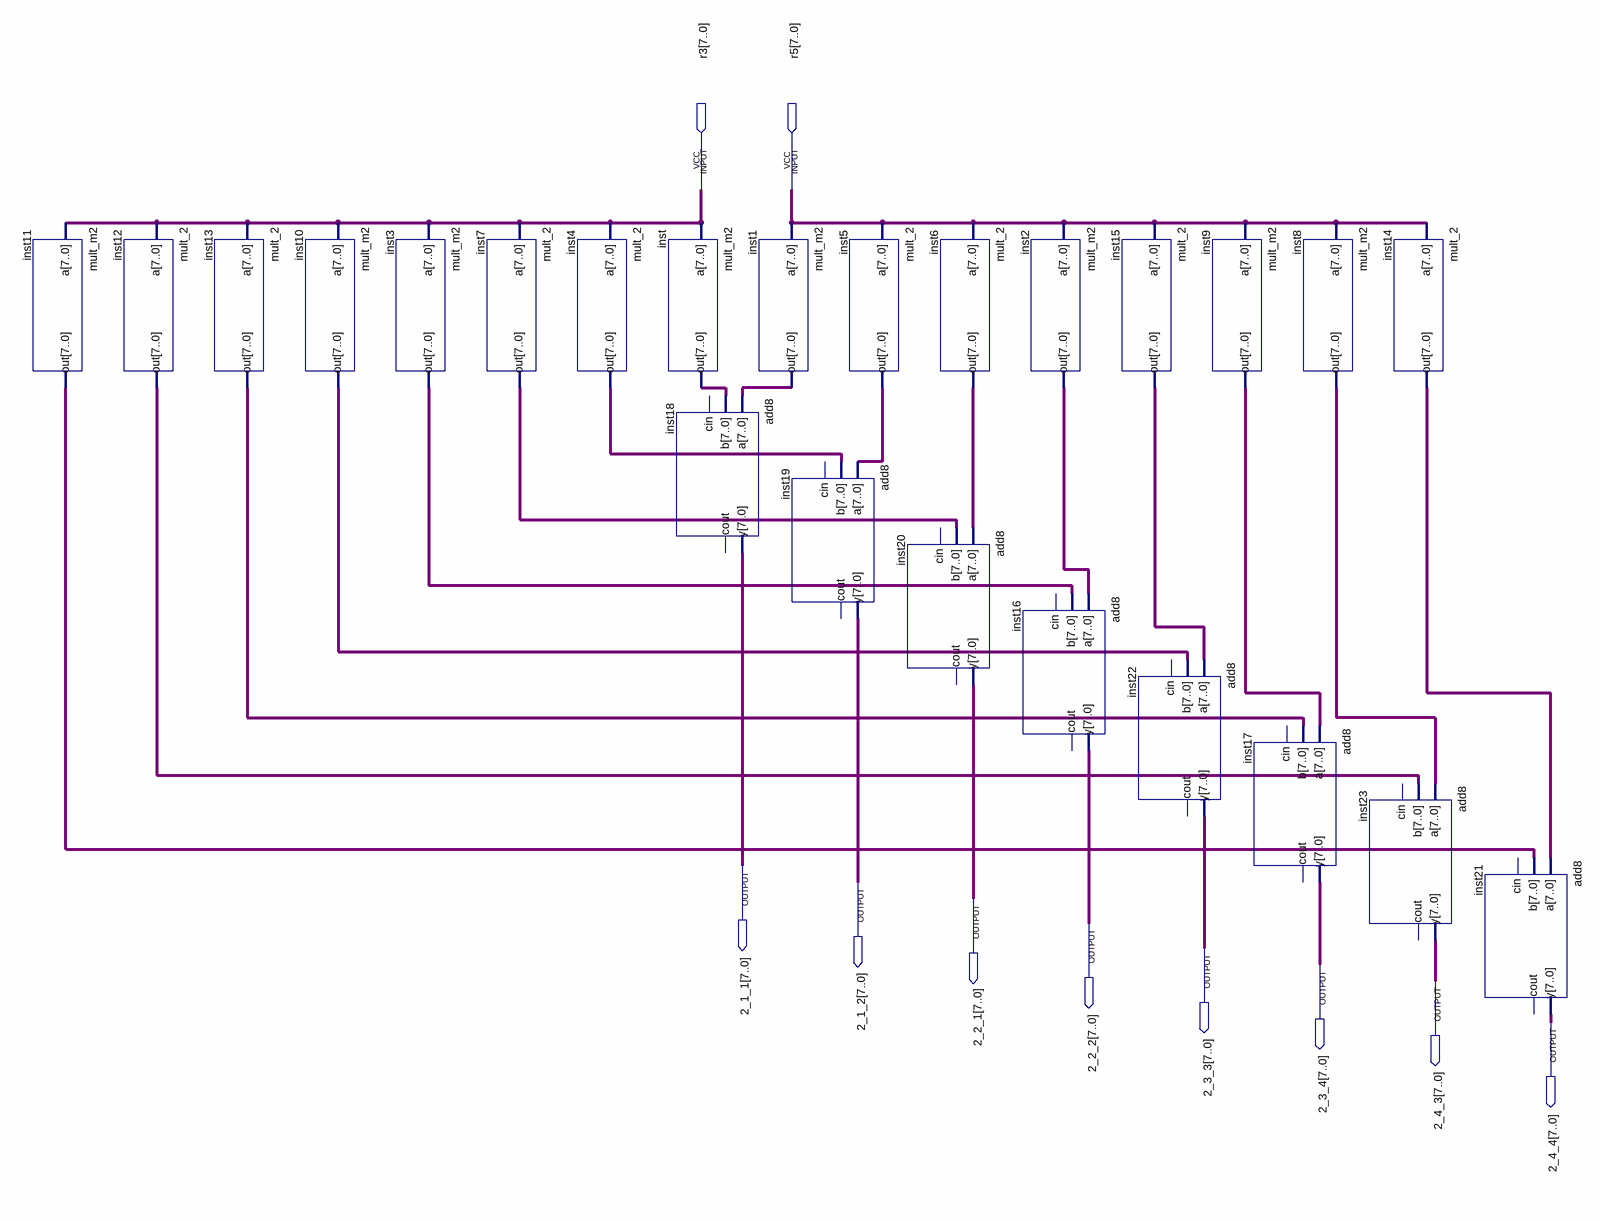
[diagram p0: schematic sheet]
// Quartus schematic stage_2.bdf as structural Verilog: 24 symbols, 10 pins
module stage_2 (
  input  [7:0] r3,
  input  [7:0] r5,
  output [7:0] \2_1_1 ,
  output [7:0] \2_1_2 ,
  output [7:0] \2_2_1 ,
  output [7:0] \2_2_2 ,
  output [7:0] \2_3_3 ,
  output [7:0] \2_3_4 ,
  output [7:0] \2_4_3 ,
  output [7:0] \2_4_4 
);

  wire [7:0] inst1_out, inst2_out, inst3_out, inst4_out, inst5_out, inst6_out, inst7_out, inst8_out,
       inst9_out, inst10_out, inst11_out, inst12_out, inst13_out, inst14_out, inst15_out, inst_out;

  mult_m2 inst11 (.a(r3), .out(inst11_out));
  mult_2 inst12 (.a(r3), .out(inst12_out));
  mult_2 inst13 (.a(r3), .out(inst13_out));
  mult_m2 inst10 (.a(r3), .out(inst10_out));
  mult_m2 inst3 (.a(r3), .out(inst3_out));
  mult_2 inst7 (.a(r3), .out(inst7_out));
  mult_2 inst4 (.a(r3), .out(inst4_out));
  mult_m2 inst (.a(r3), .out(inst_out));
  add8 inst18 (.a(inst1_out), .b(inst_out), .y(\2_1_1 ));  // open: cin, cout
  mult_m2 inst1 (.a(r5), .out(inst1_out));
  add8 inst19 (.a(inst5_out), .b(inst4_out), .y(\2_1_2 ));  // open: cin, cout
  mult_2 inst5 (.a(r5), .out(inst5_out));
  add8 inst20 (.a(inst6_out), .b(inst7_out), .y(\2_2_1 ));  // open: cin, cout
  mult_2 inst6 (.a(r5), .out(inst6_out));
  mult_m2 inst2 (.a(r5), .out(inst2_out));
  add8 inst16 (.a(inst2_out), .b(inst3_out), .y(\2_2_2 ));  // open: cin, cout
  mult_2 inst15 (.a(r5), .out(inst15_out));
  add8 inst22 (.a(inst15_out), .b(inst10_out), .y(\2_3_3 ));  // open: cin, cout
  mult_m2 inst9 (.a(r5), .out(inst9_out));
  add8 inst17 (.a(inst9_out), .b(inst13_out), .y(\2_3_4 ));  // open: cin, cout
  mult_m2 inst8 (.a(r5), .out(inst8_out));
  add8 inst23 (.a(inst8_out), .b(inst12_out), .y(\2_4_3 ));  // open: cin, cout
  mult_2 inst14 (.a(r5), .out(inst14_out));
  add8 inst21 (.a(inst14_out), .b(inst11_out), .y(\2_4_4 ));  // open: cin, cout
endmodule
